# Altium schematic sheet 1_Interface.SchDoc: OBDH Interface
size A3; DrawnBy: Sara Vega/Matheus Frata; Revision: V2.1; SheetNumber: 1; SheetTotal: 7
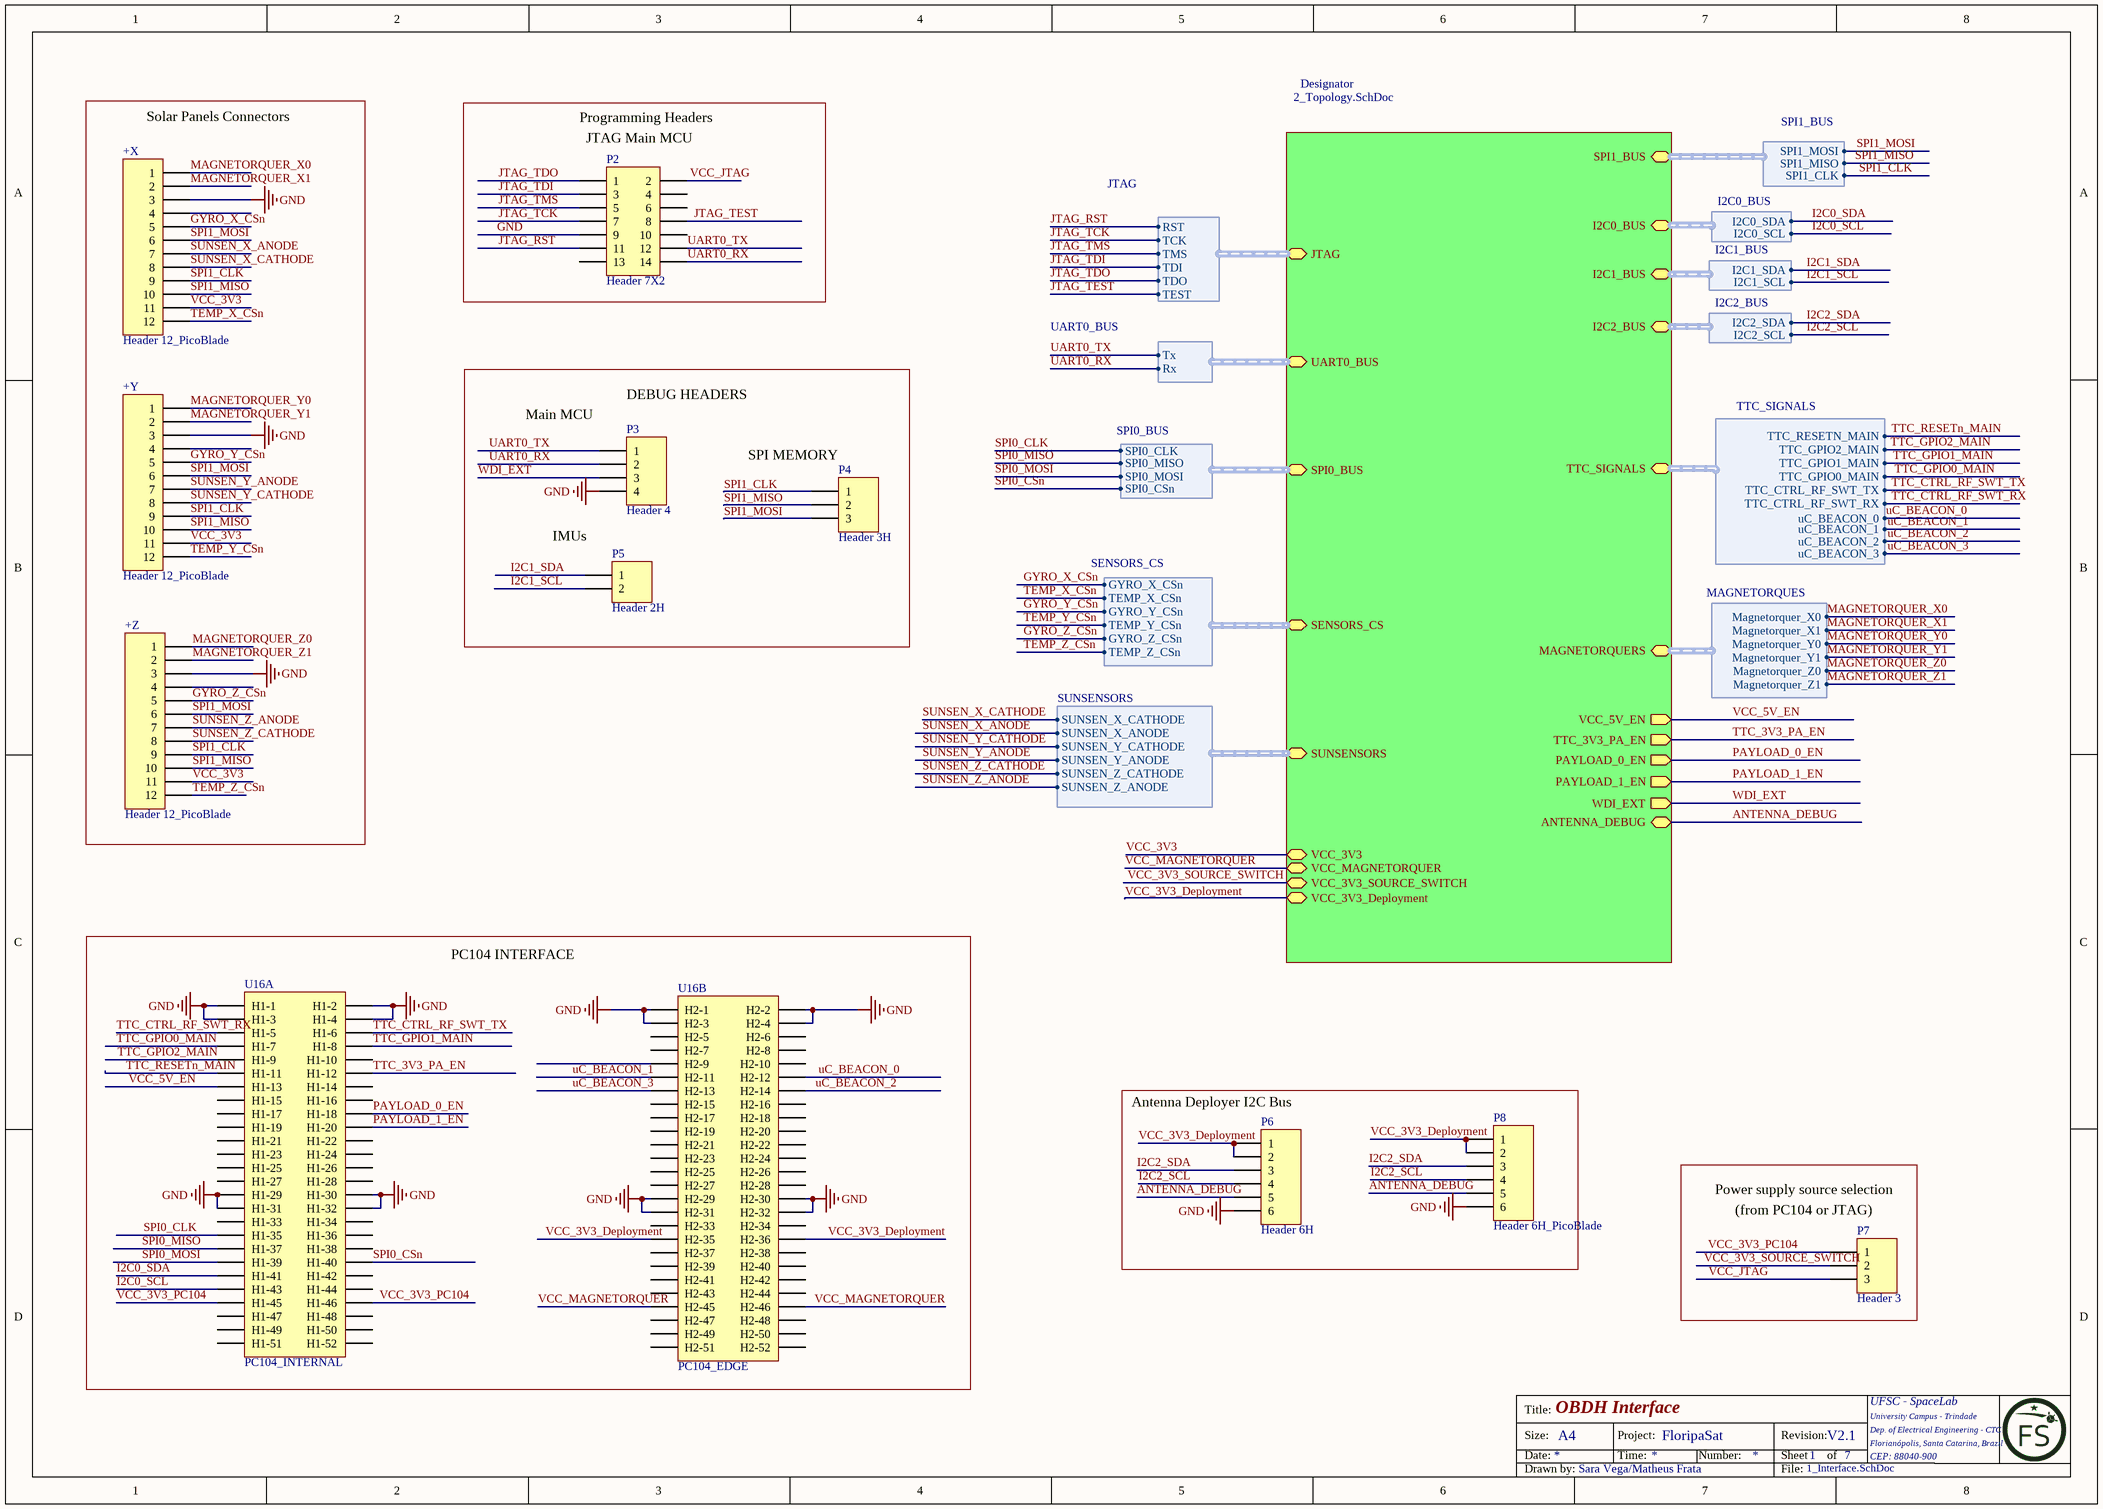
[diagram p0: 1_Interface.SchDoc]

## Parts
+X  Header 12_PicoBlade  [HDR12 PicoBlade - duplicate]
+Y  Header 12_PicoBlade  [HDR12 PicoBlade - duplicate]
+Z  Header 12_PicoBlade  [HDR12 PicoBlade - duplicate]
P2  Header 7X2  [HDR2X7]
P3  Header 4  [HDR1X4]
P4  Header 3H  [HDR 1X3]
P5  Header 2H  [HDR1X2H]
P6  Header 6H  [HDR1X6H]
P7  Header 3  [HDR1X3]
P8  Header 6H_PicoBlade  [HDR6 PicoBlade]
U16  PC104_INTERNAL  [PC104]  (parts A,B of 2)

## Blocks framed on the sheet
Solar Panels Connectors: +X +Y +Z
PC104 INTERFACE: U16
Antenna Deployer I2C Bus: P6 P8

## Sub-sheets
Designator = 2_Topology.SchDoc: JTAG (harness JTAG), VCC_3V3, PAYLOAD_0_EN (out), UART0_BUS (harness UART0_BUS), TTC_3V3_PA_EN (out), SENSORS_CS (harness SENSORS_CS), SUNSENSORS (harness SUNSENSORS), MAGNETORQUERS (harness MAGNETORQUES), VCC_5V_EN (out), VCC_MAGNETORQUER, TTC_SIGNALS (harness TTC_SIGNALS), I2C0_BUS (harness I2C0_BUS), SPI1_BUS (harness SPI1_BUS), I2C1_BUS (harness I2C1_BUS), I2C2_BUS (harness I2C2_BUS), PAYLOAD_1_EN (out), WDI_EXT (out), SPI0_BUS (harness SPI0_BUS), VCC_3V3_SOURCE_SWITCH, ANTENNA_DEBUG, VCC_3V3_Deployment

## Harnesses
JTAG: TDO, TDI, TMS, TCK, RST, TEST
UART0_BUS: Rx, Tx
SENSORS_CS: GYRO_X_CSn, TEMP_X_CSn, GYRO_Y_CSn, TEMP_Y_CSn, GYRO_Z_CSn, TEMP_Z_CSn
SUNSENSORS: SUNSEN_Z_ANODE, SUNSEN_Z_CATHODE, SUNSEN_Y_ANODE, SUNSEN_Y_CATHODE, SUNSEN_X_ANODE, SUNSEN_X_CATHODE
MAGNETORQUES: Magnetorquer_X0, Magnetorquer_X1, Magnetorquer_Y0, Magnetorquer_Y1, Magnetorquer_Z0, Magnetorquer_Z1
I2C0_BUS: I2C0_SDA, I2C0_SCL
I2C1_BUS: I2C1_SDA, I2C1_SCL
I2C2_BUS: I2C2_SDA, I2C2_SCL
SPI0_BUS: SPI0_CLK, SPI0_MISO, SPI0_MOSI, SPI0_CSn
TTC_SIGNALS: TTC_CTRL_RF_SWT_RX, TTC_CTRL_RF_SWT_TX, TTC_GPIO0_MAIN, TTC_GPIO1_MAIN, TTC_GPIO2_MAIN, TTC_RESETN_MAIN, uC_BEACON_0, uC_BEACON_1, uC_BEACON_2, uC_BEACON_3
SPI1_BUS: SPI1_CLK, SPI1_MISO, SPI1_MOSI

## Nets
GND: +X.3 +Y.3 +Z.3 P2.9 P3.4 P6.6 P8.6 U16.H1-1 U16.H1-2 U16.H1-3 U16.H1-4 U16.H1-29 U16.H1-30 U16.H1-31 U16.H1-32 U16.H2-1 U16.H2-2 U16.H2-3 U16.H2-4 U16.H2-29 U16.H2-30 U16.H2-31 U16.H2-32
ANTENNA_DEBUG: P6.5 P8.5 ; sheet Designator/ANTENNA_DEBUG
GYRO_X_CSn: +X.5 ; sheet Designator/SENSORS_CS.GYRO_X_CSn
GYRO_Y_CSn: +Y.5 ; sheet Designator/SENSORS_CS.GYRO_Y_CSn
GYRO_Z_CSn: +Z.5 ; sheet Designator/SENSORS_CS.GYRO_Z_CSn
I2C0_SCL: U16.H1-43 ; sheet Designator/I2C0_BUS.I2C0_SCL
I2C0_SDA: U16.H1-41 ; sheet Designator/I2C0_BUS.I2C0_SDA
I2C1_SCL: P5.2 ; sheet Designator/I2C1_BUS.I2C1_SCL
I2C1_SDA: P5.1 ; sheet Designator/I2C1_BUS.I2C1_SDA
I2C2_SCL: P6.4 P8.4 ; sheet Designator/I2C2_BUS.I2C2_SCL
I2C2_SDA: P6.3 P8.3 ; sheet Designator/I2C2_BUS.I2C2_SDA
JTAG_RST: P2.11 ; sheet Designator/JTAG.RST
JTAG_TCK: P2.7 ; sheet Designator/JTAG.TCK
JTAG_TDI: P2.3 ; sheet Designator/JTAG.TDI
JTAG_TDO: P2.1 ; sheet Designator/JTAG.TDO
JTAG_TEST: P2.8 ; sheet Designator/JTAG.TEST
JTAG_TMS: P2.5 ; sheet Designator/JTAG.TMS
MAGNETORQUER_X0: +X.1 ; sheet Designator/MAGNETORQUERS.Magnetorquer_X0
MAGNETORQUER_X1: +X.2 ; sheet Designator/MAGNETORQUERS.Magnetorquer_X1
MAGNETORQUER_Y0: +Y.1 ; sheet Designator/MAGNETORQUERS.Magnetorquer_Y0
MAGNETORQUER_Y1: +Y.2 ; sheet Designator/MAGNETORQUERS.Magnetorquer_Y1
MAGNETORQUER_Z0: +Z.1 ; sheet Designator/MAGNETORQUERS.Magnetorquer_Z0
MAGNETORQUER_Z1: +Z.2 ; sheet Designator/MAGNETORQUERS.Magnetorquer_Z1
PAYLOAD_0_EN: U16.H1-18 ; sheet Designator/PAYLOAD_0_EN
PAYLOAD_1_EN: U16.H1-20 ; sheet Designator/PAYLOAD_1_EN
SPI0_CLK: U16.H1-35 ; sheet Designator/SPI0_BUS.SPI0_CLK
SPI0_CSn: U16.H1-40 ; sheet Designator/SPI0_BUS.SPI0_CSn
SPI0_MISO: U16.H1-37 ; sheet Designator/SPI0_BUS.SPI0_MISO
SPI0_MOSI: U16.H1-39 ; sheet Designator/SPI0_BUS.SPI0_MOSI
SPI1_CLK: +X.9 +Y.9 +Z.9 P4.1 ; sheet Designator/SPI1_BUS.SPI1_CLK
SPI1_MISO: +X.10 +Y.10 +Z.10 P4.2 ; sheet Designator/SPI1_BUS.SPI1_MISO
SPI1_MOSI: +X.6 +Y.6 +Z.6 P4.3 ; sheet Designator/SPI1_BUS.SPI1_MOSI
SUNSEN_X_ANODE: +X.7 ; sheet Designator/SUNSENSORS.SUNSEN_X_ANODE
SUNSEN_X_CATHODE: +X.8 ; sheet Designator/SUNSENSORS.SUNSEN_X_CATHODE
SUNSEN_Y_ANODE: +Y.7 ; sheet Designator/SUNSENSORS.SUNSEN_Y_ANODE
SUNSEN_Y_CATHODE: +Y.8 ; sheet Designator/SUNSENSORS.SUNSEN_Y_CATHODE
SUNSEN_Z_ANODE: +Z.7 ; sheet Designator/SUNSENSORS.SUNSEN_Z_ANODE
SUNSEN_Z_CATHODE: +Z.8 ; sheet Designator/SUNSENSORS.SUNSEN_Z_CATHODE
TEMP_X_CSn: +X.12 ; sheet Designator/SENSORS_CS.TEMP_X_CSn
TEMP_Y_CSn: +Y.12 ; sheet Designator/SENSORS_CS.TEMP_Y_CSn
TEMP_Z_CSn: +Z.12 ; sheet Designator/SENSORS_CS.TEMP_Z_CSn
TTC_3V3_PA_EN: U16.H1-12 ; sheet Designator/TTC_3V3_PA_EN
TTC_CTRL_RF_SWT_RX: U16.H1-5 ; sheet Designator/TTC_SIGNALS.TTC_CTRL_RF_SWT_RX
TTC_CTRL_RF_SWT_TX: U16.H1-6 ; sheet Designator/TTC_SIGNALS.TTC_CTRL_RF_SWT_TX
TTC_GPIO0_MAIN: U16.H1-7 ; sheet Designator/TTC_SIGNALS.TTC_GPIO0_MAIN
TTC_GPIO1_MAIN: U16.H1-8 ; sheet Designator/TTC_SIGNALS.TTC_GPIO1_MAIN
TTC_GPIO2_MAIN: U16.H1-9 ; sheet Designator/TTC_SIGNALS.TTC_GPIO2_MAIN
TTC_RESETn_MAIN: U16.H1-11 ; sheet Designator/TTC_SIGNALS.TTC_RESETN_MAIN
UART0_RX: P2.14 P3.2 ; sheet Designator/UART0_BUS.Rx
UART0_TX: P2.12 P3.1 ; sheet Designator/UART0_BUS.Tx
uC_BEACON_0: U16.H2-12 ; sheet Designator/TTC_SIGNALS.uC_BEACON_0
uC_BEACON_1: U16.H2-11 ; sheet Designator/TTC_SIGNALS.uC_BEACON_1
uC_BEACON_2: U16.H2-14 ; sheet Designator/TTC_SIGNALS.uC_BEACON_2
uC_BEACON_3: U16.H2-13 ; sheet Designator/TTC_SIGNALS.uC_BEACON_3
VCC_3V3: +X.11 +Y.11 +Z.11 ; sheet Designator/VCC_3V3
VCC_3V3_Deployment: P6.1 P6.2 P8.1 P8.2 U16.H2-35 U16.H2-36 ; sheet Designator/VCC_3V3_Deployment
VCC_3V3_PC104: P7.1 U16.H1-45 U16.H1-46
VCC_3V3_SOURCE_SWITCH: P7.2 ; sheet Designator/VCC_3V3_SOURCE_SWITCH
VCC_5V_EN: U16.H1-13 ; sheet Designator/VCC_5V_EN
VCC_JTAG: P2.2 P7.3
VCC_MAGNETORQUER: U16.H2-45 U16.H2-46 ; sheet Designator/VCC_MAGNETORQUER
WDI_EXT: P3.3 ; sheet Designator/WDI_EXT

Not connected (* = marked no-connect by the designer): +X 4; +Y 4; +Z 4; P2 4 6 10 13; U16 H1-10 H1-14 H1-15 H1-16 H1-17 H1-19 H1-21 H1-22 H1-23 H1-24 H1-25 H1-26 H1-27 H1-28 H1-33 H1-34 H1-36 H1-38 H1-42 H1-44 H1-47 H1-48 H1-49 H1-50 H1-51 H1-52 H2-5 H2-6 H2-7 H2-8 H2-9 H2-10 H2-15 H2-16 H2-17 H2-18 H2-19 H2-20 H2-21 H2-22 H2-23 H2-24 H2-25 H2-26 H2-27 H2-28 H2-33 H2-34 H2-37 H2-38 H2-39 H2-40 H2-41 H2-42 H2-43 H2-44 H2-47 H2-48 H2-49 H2-50 H2-51 H2-52

## Notes on the sheet
- Programming Headers
- (near P2) JTAG Main MCU
- (near P3) Main MCU
- (near P3) DEBUG HEADERS
- (near P4) SPI MEMORY
- IMUs
- (near P7) Power supply source selection
- (near P7) (from PC104 or JTAG)
- Title:
- Size:
- Date:
- A4
- Project:
- Time:
- FloripaSat
- Number:
- Revision:
- Sheet
- of
- UFSC - SpaceLab
- University Campus - Trindade
- Dep. of Electrical Engineering - CTC
- Florianópolis, Santa Catarina, Brazil
- CEP: 88040-900
- Drawn by:
- File:

## Library data of the parts
+X +Y = Header 12_PicoBlade: Header, 12-Pin; PartNumber: 53398-1271; LatestRevisionDate: 17-Jul-2002; LatestRevisionNote: Re-released for DXP Platform.; Publisher: Altium Limited
+Z = Header 12_PicoBlade: Header, 12-Pin; PartNumber: 533981271; LatestRevisionDate: 17-Jul-2002; LatestRevisionNote: Re-released for DXP Platform.; Publisher: Altium Limited
P2 = Header 7X2: Header, 7-Pin, Dual row; LatestRevisionDate: 17-Jul-2002; LatestRevisionNote: Re-released for DXP Platform.; Publisher: Altium Limited
P3 = Header 4: Header, 4-Pin; LatestRevisionDate: 17-Jul-2002; LatestRevisionNote: Re-released for DXP Platform.; Publisher: Altium Limited
P4 = Header 3H: Header, 3-Pin, Right Angle; Partnumber: 4-103327-5; LatestRevisionDate: 17-Jul-2002; LatestRevisionNote: Re-released for DXP Platform.; Publisher: Altium Limited
P5 = Header 2H: Header, 2-Pin, Right Angle; LatestRevisionDate: 17-Jul-2002; LatestRevisionNote: Re-released for DXP Platform.; Publisher: Altium Limited
P6 = Header 6H: Header, 6-Pin, Right Angle; LatestRevisionDate: 17-Jul-2002; LatestRevisionNote: Re-released for DXP Platform.; Publisher: Altium Limited
P7 = Header 3: Header, 3-Pin; LatestRevisionDate: 17-Jul-2002; LatestRevisionNote: Re-released for DXP Platform.; Publisher: Altium Limited
P8 = Header 6H_PicoBlade: Header, 6-Pin, Right Angle; Partnumber: 53398-0671; LatestRevisionDate: 17-Jul-2002; LatestRevisionNote: Re-released for DXP Platform.; Publisher: Altium Limited
U16 = PC104: Partnumber: ESQ-126-39-G-D